# EasyEDA schematic Sheet_1.json
TITLE: Sheet_1; REV: 1.0; Date: 2024-01-28; Sheet: 1/1; Drawn By: Qinh; Company: Your Company
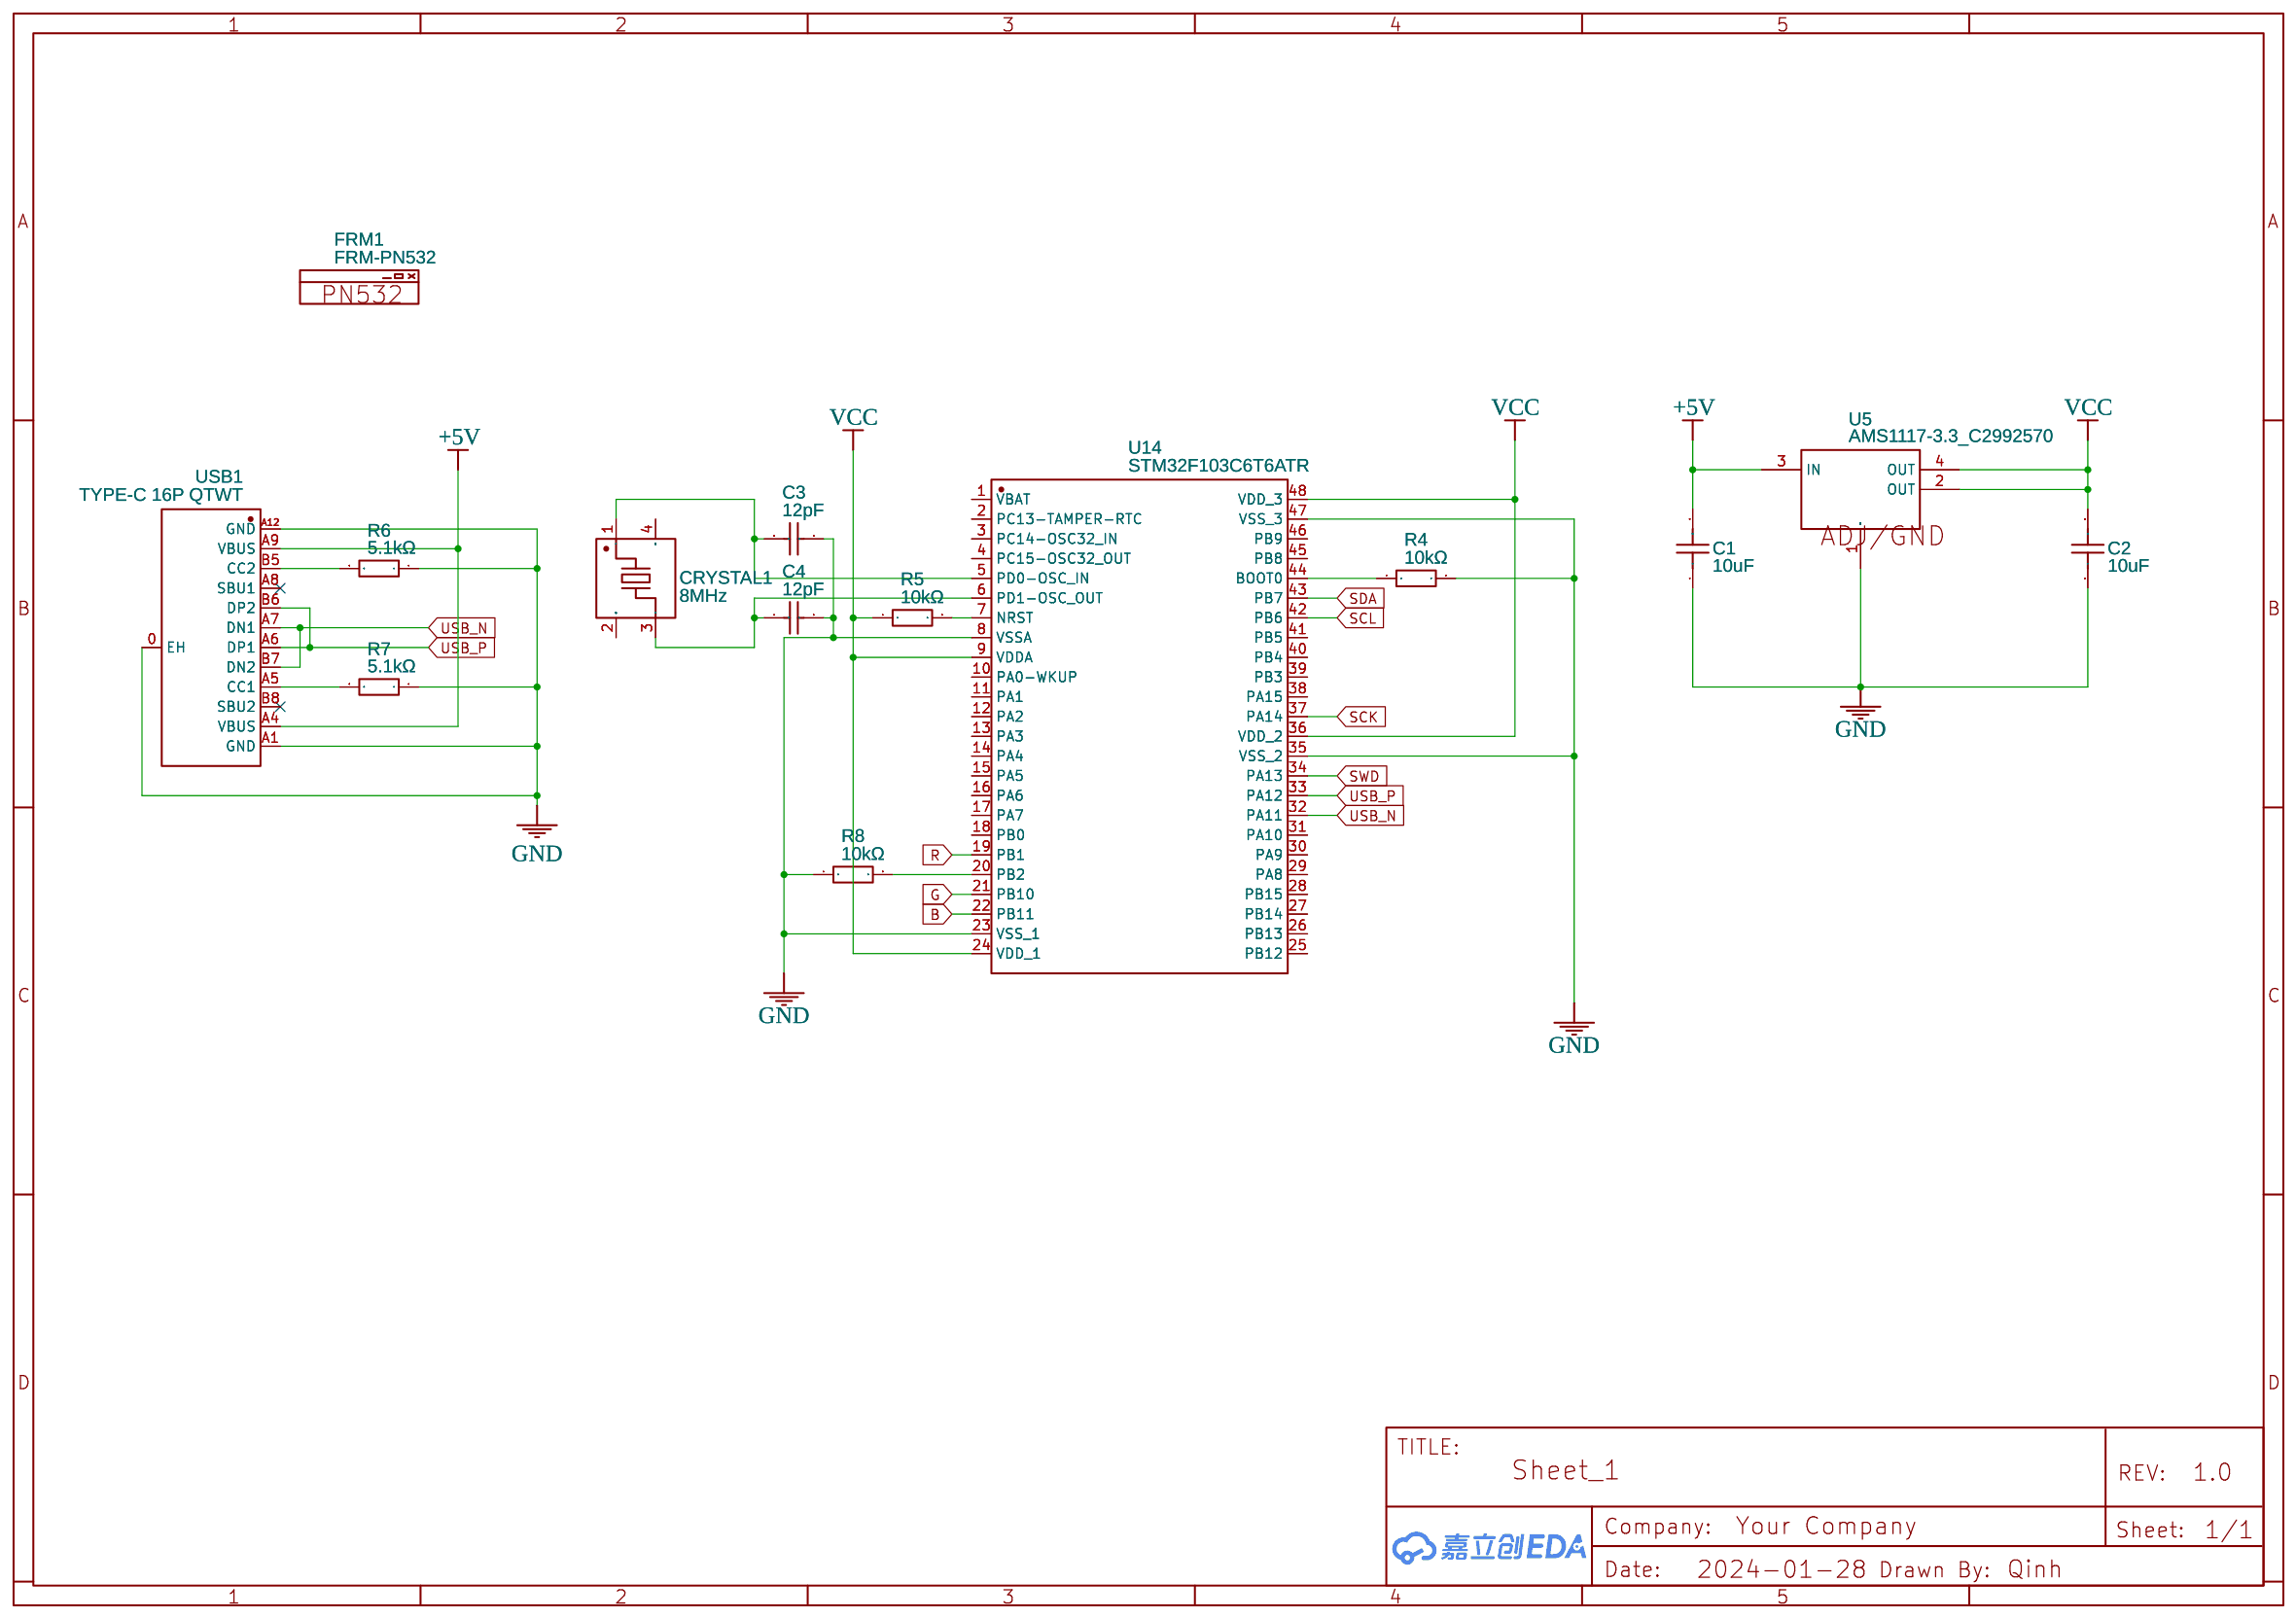
[diagram p0: schematic sheet]

## Parts
C1  10uF  [C0603]
C2  10uF  [C0603]
C3  12pF  [C0603]
C4  12pF  [C0603]
CRYSTAL1  8MHz  [CRYSTAL-SMD_4P-L3.2-W2.5-BL_SIT8008BI]
FRM1  FRM-PN532  [FRM-PN532]
R4  10kΩ  [R0603]
R5  10kΩ  [R0603]
R6  5.1kΩ  [R0603]
R7  5.1kΩ  [R0603]
R8  10kΩ  [R0603]
U5  AMS1117-3.3_C2992570  [SOT-223-3_L6.4-W3.5-P2.30-LS7.0-BR]
U14  STM32F103C6T6ATR  [LQFP-48_L7.0-W7.0-P0.50-LS9.0-BL]
USB1  TYPE-C 16P QTWT  [USB-TYPE-C-SMD_TYPE-C-16P-QTWT]

## Library data of the parts
C1 C2 = CL10A106KP8NNNC: Supplier: LCSC; Manufacturer: SAMSUNG(三星); Supplier Part: C19702; JLCPCB Part Class: Basic Part
C3 C4 = CL10C120JB8NNNC: Supplier: LCSC; Manufacturer: SAMSUNG(三星); Supplier Part: C38523; JLCPCB Part Class: Basic Part
CRYSTAL1 = CF4008M00012001: Supplier: LCSC; Supplier Part: C7294546; Manufacturer: HUAXIN(华昕); Contributor: lcsc; JLCPCB Part Class: Extended Part
FRM1 = FRM-PN532: Contributor: yihai
R4 R5 R8 = 0603WAF1002T5E: Supplier: LCSC; Manufacturer: UNI-ROYAL(厚声); Supplier Part: C25804; JLCPCB Part Class: Basic Part
R6 R7 = RMC06035.1K1%N: Supplier: LCSC; Supplier Part: C269716; Manufacturer: Tyohm(幸亚电阻); Resistance (Ohms): 5.1K; Contributor: LCSC; JLCPCB Part Class: Extended Part
U5 = AMS1117-3.3_C2992570: Supplier: LCSC; Supplier Part: C2992570; Manufacturer: 国芯佳品; Manufacturer Part: AMS1117-3.3; link: https://atta.szlcsc.comnull; Contributor: lcsc; JLCPCB Part Class: Extended Part
U14 = STM32F103C6T6ATR: Contributor: LCSC; Supplier: LCSC; Supplier Part: C2053946; Manufacturer: ST(意法半导体); JLCPCB Part Class: Extended Part
USB1 = TYPE-C 16P QTWT: Contributor: lcsc; Supplier: LCSC; Supplier Part: C5187472; Manufacturer: SHOU HAN(首韩); JLCPCB Part Class: Extended Part

## Nets
+5V: C1.2 U5.3(IN) USB1.A4(VBUS) USB1.A9(VBUS)
GND: C1.1 C2.1 C3.2 C4.2 R4.2 R6.1 R7.1 R8.1 U5.1(ADJ/GND) U14.8(VSSA) U14.23(VSS_1) U14.35(VSS_2) U14.47(VSS_3) USB1.0(EH) USB1.A1(GND) USB1.A12(GND)
VCC: C2.2 R5.1 U5.2(OUT) U5.4(OUT) U14.9(VDDA) U14.24(VDD_1) U14.36(VDD_2) U14.48(VDD_3)
B: U14.22(PB11)
G: U14.21(PB10)
R: U14.19(PB1)
SCK: U14.37(PA14)
SCL: U14.42(PB6)
SDA: U14.43(PB7)
SWD: U14.34(PA13)
USB_N: U14.32(PA11) USB1.A7(DN1) USB1.B7(DN2)
USB_P: U14.33(PA12) USB1.A6(DP1) USB1.B6(DP2)
Net-(C3-1): C3.1 CRYSTAL1.1 U14.5(PD0-OSC_IN)
Net-(C4-1): C4.1 CRYSTAL1.3 U14.6(PD1-OSC_OUT)
Net-(R4-1): R4.1 U14.44(BOOT0)
Net-(R5-2): R5.2 U14.7(NRST)
Net-(R6-2): R6.2 USB1.B5(CC2)
Net-(R7-2): R7.2 USB1.A5(CC1)
Net-(R8-2): R8.2 U14.20(PB2)

Not connected (* = marked no-connect by the designer): CRYSTAL1 2(GND) 4(GND); U14 1(VBAT) 2(PC13-TAMPER-RTC) 3(PC14-OSC32_IN) 4(PC15-OSC32_OUT) 10(PA0-WKUP) 11(PA1) 12(PA2) 13(PA3) 14(PA4) 15(PA5) 16(PA6) 17(PA7) 18(PB0) 25(PB12) 26(PB13) 27(PB14) 28(PB15) 29(PA8) 30(PA9) 31(PA10) 38(PA15) 39(PB3) 40(PB4) 41(PB5) 45(PB8) 46(PB9); USB1 A8(SBU1)* B8(SBU2)*
